# Altium schematic sheet bal2un_2.SchDoc
size A4
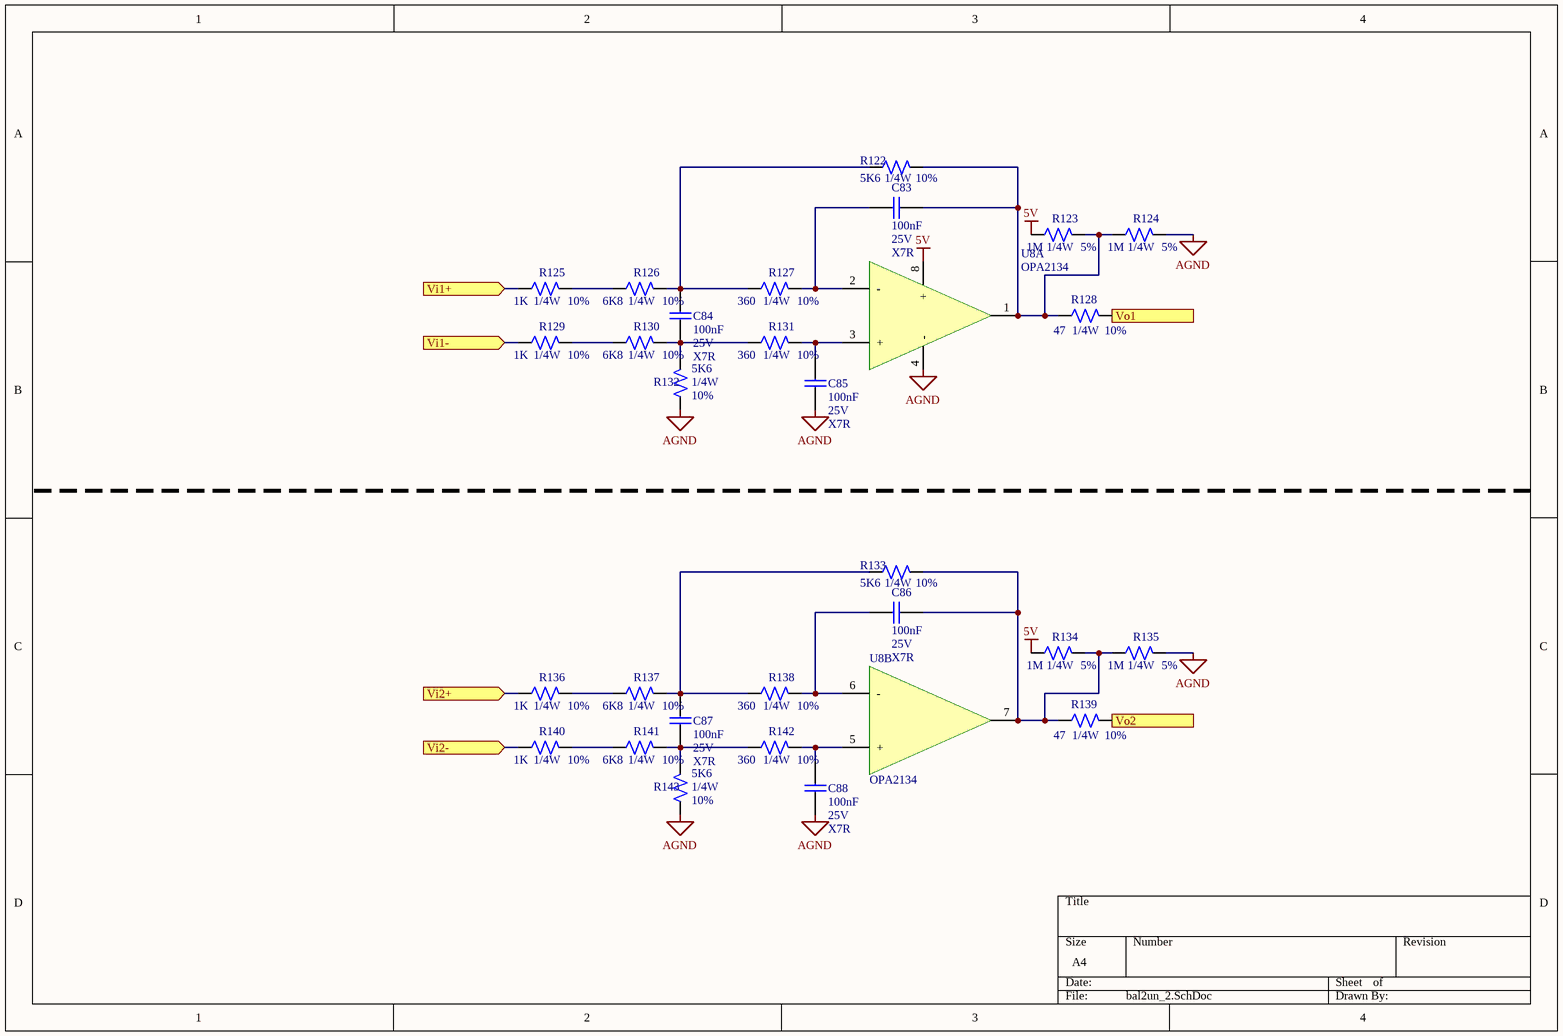
[diagram p0: bal2un_2.SchDoc]

## Parts
C83  valor: 100nF  tension: 25V  tolerancia: X7R  [C0805]  (hidden comment: Capacitor)
C84  valor: 100nF  tension: 25V  tolerancia: X7R  [C0805]  (hidden comment: Capacitor)
C85  valor: 100nF  tension: 25V  tolerancia: X7R  [C0805]  (hidden comment: Capacitor)
C86  valor: 100nF  tension: 25V  tolerancia: X7R  [C0805]  (hidden comment: Capacitor)
C87  valor: 100nF  tension: 25V  tolerancia: X7R  [C0805]  (hidden comment: Capacitor)
C88  valor: 100nF  tension: 25V  tolerancia: X7R  [C0805]  (hidden comment: Capacitor)
R122  Valor: 5K6  Potencia: 1/4W  Tolerancia: 10%  [R0805]  (hidden comment: Resistor)
R123  Valor: 1M  Potencia: 1/4W  Tolerancia: 5%  [R0805]  (hidden comment: Resistor)
R124  Valor: 1M  Potencia: 1/4W  Tolerancia: 5%  [R0805]  (hidden comment: Resistor)
R125  Valor: 1K  Potencia: 1/4W  Tolerancia: 10%  [R0805]  (hidden comment: Resistor)
R126  Valor: 6K8  Potencia: 1/4W  Tolerancia: 10%  [R0805]  (hidden comment: Resistor)
R127  Valor: 360  Potencia: 1/4W  Tolerancia: 10%  [R0805]  (hidden comment: Resistor)
R128  Valor: 47  Potencia: 1/4W  Tolerancia: 10%  [R0805]  (hidden comment: Resistor)
R129  Valor: 1K  Potencia: 1/4W  Tolerancia: 10%  [R0805]  (hidden comment: Resistor)
R130  Valor: 6K8  Potencia: 1/4W  Tolerancia: 10%  [R0805]  (hidden comment: Resistor)
R131  Valor: 360  Potencia: 1/4W  Tolerancia: 10%  [R0805]  (hidden comment: Resistor)
R132  Valor: 5K6  Potencia: 1/4W  Tolerancia: 10%  [R0805]  (hidden comment: Resistor)
R133  Valor: 5K6  Potencia: 1/4W  Tolerancia: 10%  [R0805]  (hidden comment: Resistor)
R134  Valor: 1M  Potencia: 1/4W  Tolerancia: 5%  [R0805]  (hidden comment: Resistor)
R135  Valor: 1M  Potencia: 1/4W  Tolerancia: 5%  [R0805]  (hidden comment: Resistor)
R136  Valor: 1K  Potencia: 1/4W  Tolerancia: 10%  [R0805]  (hidden comment: Resistor)
R137  Valor: 6K8  Potencia: 1/4W  Tolerancia: 10%  [R0805]  (hidden comment: Resistor)
R138  Valor: 360  Potencia: 1/4W  Tolerancia: 10%  [R0805]  (hidden comment: Resistor)
R139  Valor: 47  Potencia: 1/4W  Tolerancia: 10%  [R0805]  (hidden comment: Resistor)
R140  Valor: 1K  Potencia: 1/4W  Tolerancia: 10%  [R0805]  (hidden comment: Resistor)
R141  Valor: 6K8  Potencia: 1/4W  Tolerancia: 10%  [R0805]  (hidden comment: Resistor)
R142  Valor: 360  Potencia: 1/4W  Tolerancia: 10%  [R0805]  (hidden comment: Resistor)
R143  Valor: 5K6  Potencia: 1/4W  Tolerancia: 10%  [R0805]  (hidden comment: Resistor)
U8  OPA2134  [D8]  (parts A,B of 2)

## Ports
Vi1+ (in), Vi1- (in), Vi2+ (in), Vi2- (in), Vo1 (out), Vo2 (out)

## Nets
5V: R123.1 R134.1 U8.8(+)
AGND: C85.2 C88.2 R124.2 R132.1 R135.2 R143.1 U8.4(-)
Vi1+: R125.1 ; port Vi1+
Vi1-: R129.1 ; port Vi1-
Vi2+: R136.1 ; port Vi2+
Vi2-: R140.1 ; port Vi2-
Vo1: R128.2 ; port Vo1
Vo2: R139.2 ; port Vo2
NetC83_1: C83.1 R122.2 R123.2 R124.1 R128.1 U8.1(OUT)
NetC83_2: C83.2 R127.2 U8.2(-)
NetC84_1: C84.1 R122.1 R126.2 R127.1
NetC84_2: C84.2 R130.2 R131.1 R132.2
NetC85_1: C85.1 R131.2 U8.3(+)
NetC86_1: C86.1 R133.2 R134.2 R135.1 R139.1 U8.7(OUT)
NetC86_2: C86.2 R138.2 U8.6(-)
NetC87_1: C87.1 R133.1 R137.2 R138.1
NetC87_2: C87.2 R141.2 R142.1 R143.2
NetC88_1: C88.1 R142.2 U8.5(+)
NetR125_2: R125.2 R126.1
NetR129_2: R129.2 R130.1
NetR136_2: R136.2 R137.1
NetR140_2: R140.2 R141.1

## Library data of the parts
C83-C88 = Capacitor: Capacitor de placas paralelas; Encapsulado: 0805
R122-R143 = Resistor: Resistencia
U8 = Opamp_x2: Integrado con 2 operacionales; Cod. Proveedor: 296-22024-1-ND; Proveedor: Digi-Key; Encapsulado: 8-SOIC; Fabricante: Texas Instruments; Link: https://www.digikey.com/product-detail/es/OPA2134UA-2K5/296-22024-1-ND/301154?utm_campaign=buynow&WT.z_cid=ref_octopart_dkc_buynow&utm_medium=aggregator&curr=usd&site=us&utm_source=octopart